# EAGLE design v1 (EAGLE 8.5.1)

## Sheet 1 of 4: power
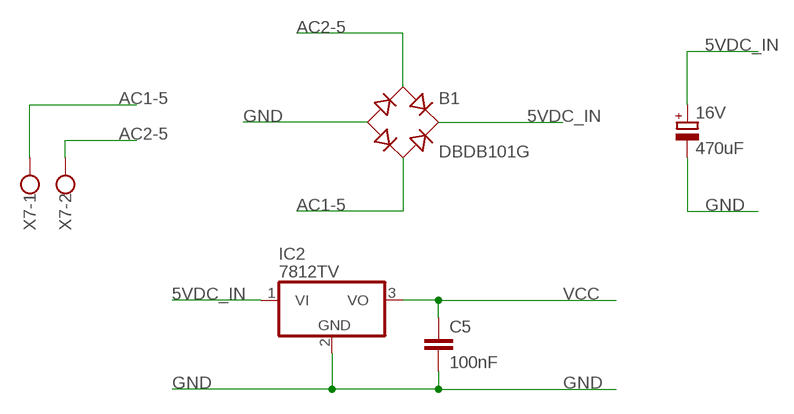
[diagram p0: schematic, sheet 1]

### Parts
16V  470uF  CPOL-EUE3.5-8  [E3,5-8]
B1  DBDB101G  [DB]
C5  100nF  C-EU050-025X075  [C050-025X075]
IC2  7812TV  [TO220V]
X7  W237-102  [W237-102]

### Nets
5VDC_IN: 16V.+ B1.+ IC2.1(VI) ; also sheet 4
AC1-5: B1.AC2 X7.1
AC2-5: B1.AC1 X7.2
GND: 16V.- B1.- C5.2 IC2.2(GND) ; also sheet 2,3,4
VCC: C5.1 IC2.3(VO) ; also sheet 2,3

## Sheet 2 of 4
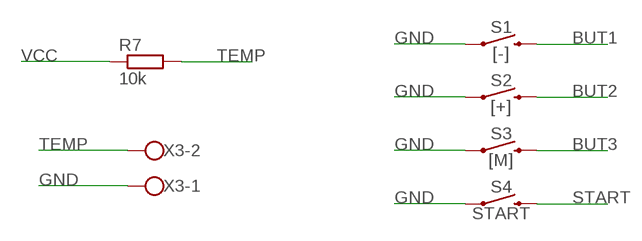
[diagram p1: schematic, sheet 2]

### Parts
R7  10k  R-EU_0207/10  [0207/10]
S1  [-]  MOMENTARY-SWITCH-SPST-PTH-6.0MM  [TACTILE_SWITCH_PTH_6.0MM]
S2  [+]  MOMENTARY-SWITCH-SPST-PTH-6.0MM  [TACTILE_SWITCH_PTH_6.0MM]
S3  [M]  MOMENTARY-SWITCH-SPST-PTH-6.0MM  [TACTILE_SWITCH_PTH_6.0MM]
S4  START  MOMENTARY-SWITCH-SPST-PTH-6.0MM  [TACTILE_SWITCH_PTH_6.0MM]
X3  W237-102  [W237-102]

### Nets
BUT1: S1.3 ; also sheet 3
BUT2: S2.3 ; also sheet 3
BUT3: S3.3 ; also sheet 3
GND: S1.1 S2.1 S3.1 S4.1 X3.1 ; also sheet 1,3,4
START: S4.3 ; also sheet 3
TEMP: R7.2 X3.2 ; also sheet 3
VCC: R7.1 ; also sheet 1,3

## Sheet 3 of 4: process
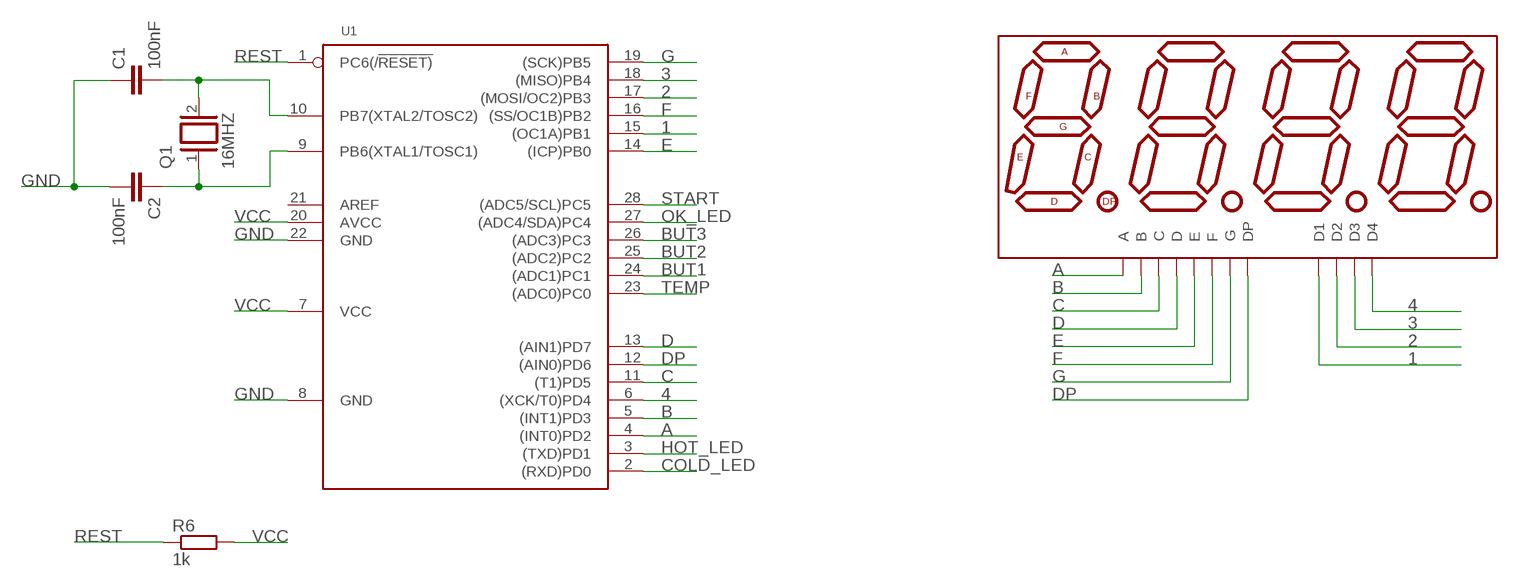
[diagram p2: schematic, sheet 3]

### Parts
C1  100nF  C-EU050-025X075  [C050-025X075]
C2  100nF  C-EU050-025X075  [C050-025X075]
DISP2  ATA8041AB  7-SEGMENT-4DIGIT-20MM-BLUE  [7-SEGMENT-4DIGIT-20MM]
Q1  16MHZ  XTAL/S  [QS]
R6  1k  R-EU_0207/10  [0207/10]
U1  MCU-ATMEGA328P-PU(DIP28)  [DIP28-2.54-34.7X7.62MM]

### Nets
1: DISP2.12(D1) U1.15((OC1A)PB1)
2: DISP2.9(D2) U1.17((MOSI/OC2)PB3)
3: DISP2.8(D3) U1.18((MISO)PB4)
4: DISP2.6(D4) U1.6((XCK/T0)PD4)
A: DISP2.11(A) U1.4((INT0)PD2)
B: DISP2.7(B) U1.5((INT1)PD3)
BUT1: U1.24((ADC1)PC1) ; also sheet 2
BUT2: U1.25((ADC2)PC2) ; also sheet 2
BUT3: U1.26((ADC3)PC3) ; also sheet 2
C: DISP2.4(C) U1.11((T1)PD5)
COLD_LED: U1.2((RXD)PD0) ; also sheet 4
D: DISP2.2(D) U1.13((AIN1)PD7)
DP: DISP2.3(DP) U1.12((AIN0)PD6)
E: DISP2.1(E) U1.14((ICP)PB0)
F: DISP2.10(F) U1.16((SS/OC1B)PB2)
G: DISP2.5(G) U1.19((SCK)PB5)
GND: C1.1 C2.2 U1.8(GND) U1.22(GND) ; also sheet 1,2,4
HOT_LED: U1.3((TXD)PD1) ; also sheet 4
N$1: C1.2 Q1.2 U1.10(PB7(XTAL2/TOSC2))
N$2: C2.1 Q1.1 U1.9(PB6(XTAL1/TOSC1))
OK_LED: U1.27((ADC4/SDA)PC4) ; also sheet 4
REST: R6.1 U1.1(PC6(/!RESET))
START: U1.28((ADC5/SCL)PC5) ; also sheet 2
TEMP: U1.23((ADC0)PC0) ; also sheet 2
VCC: R6.2 U1.7(VCC) U1.20(AVCC) ; also sheet 1,2
Unconnected: U1.21(AREF)

## Sheet 4 of 4: output
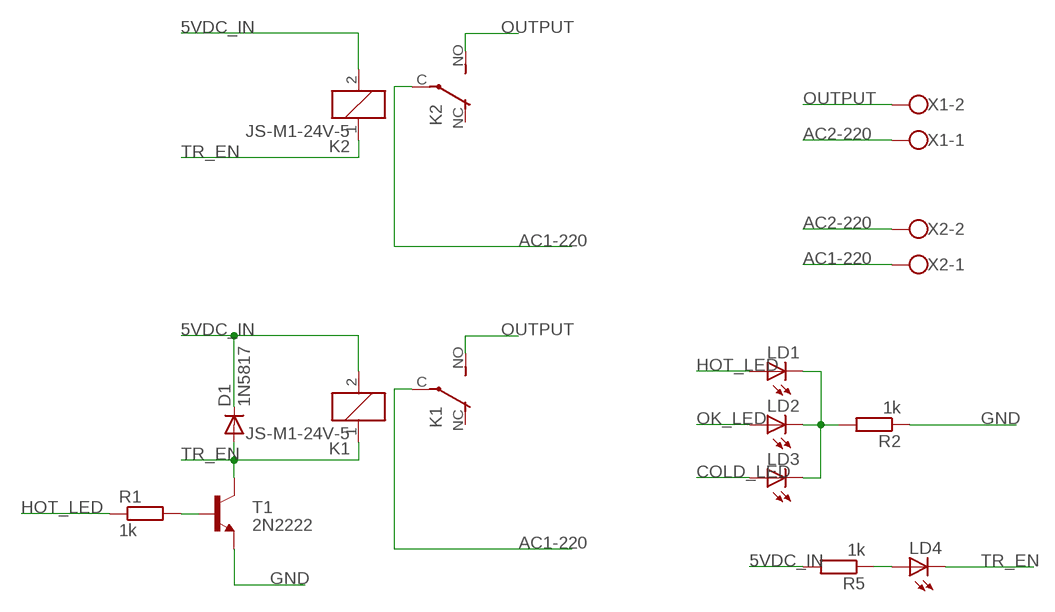
[diagram p3: schematic, sheet 4]

### Parts
D1  1N5817  1N4004  [DO41-10]
K1  JS-M1-24V-5  JS-M1-12V-5  [JS-M]
K2  JS-M1-24V-5  JS-M1-12V-5  [JS-M]
LD1  LED5MM  [LED5MM]
LD2  LED5MM  [LED5MM]
LD3  LED5MM  [LED5MM]
LD4  LED5MM  [LED5MM]
R1  1k  R-EU_0207/10  [0207/10]
R2  1k  R-EU_0207/10  [0207/10]
R5  1k  R-EU_0207/10  [0207/10]
T1  2N2222  [TO92-EBC-OVAL]
X1  W237-102  [W237-102]
X2  W237-102  [W237-102]

### Nets
5VDC_IN: D1.C K1.2 K2.2 R5.2 ; also sheet 1
AC1-220: K1.C(2:P) K2.C(2:P) X2.1
AC2-220: X1.1 X2.2
COLD_LED: LD3.A ; also sheet 3
GND: R2.1 T1.E ; also sheet 1,2,3
HOT_LED: LD1.A R1.1 ; also sheet 3
N$3: LD4.A R5.1
N$4: LD1.K(C) LD2.K(C) LD3.K(C) R2.2
N$7: R1.2 T1.B
OK_LED: LD2.A ; also sheet 3
OUTPUT: K1.NO(2:S) K2.NO(2:S) X1.2
TR_EN: D1.A K1.1 K2.1 LD4.K(C) T1.C
Unconnected: K1.NC(2:O) K2.NC(2:O)

## Library data of the parts
16V = rcl:CPOL-EU: POLARIZED CAPACITOR, European symbol; SPICEPREFIX: C
B1 = rectifier:DB?*G: Single Phase 1.0 AMP Glass Passivated Bridge Rectifier Taiwan Semiconductor Co.,Ltd. - TSC Source: http://www.taiwansemi.com/TSCbig5/ezcatfiles/cust/img/img/db101g.pdf http://www.ts.com.tw/db/pictures/modules/PDT/PDT060207001/DBLS201G.pdf
C1 C2 C5 = rcl:C-EU: CAPACITOR, European symbol; SPICEPREFIX: C
D1 = adafruit:1N4004: DIODE General purpose 1N400x type rectifier (With bigger pads) http://www.ladyada.net/library/pcb/eaglelibrary.html
DISP2 = SparkFun-LED:7-SEGMENT-4DIGIT-20MM: 4 Digit 7 Segment Display This is a part for the 4-Digit 7-segment LEDs from Young Sun. Different from the Digikey LEDs, all 16 pins are used. The LONGPADS Variant is used for a test jig, but you may like it because there is more pad to solder to. If you are concerned about routing space, the standard works just fine though. Datasheets: Red <http://cdn.sparkfun.com/datasheets/Components/LED/1LEDREDCC.pdf> Yellow <http://cdn.sparkfun.com/datasheets/Components/LED/1LEDYELCC.pdf> Green <http://cdn.sparkfun.com/datasheets/Components/LED/1LEDGRNCC.pdf> Blue <http://cdn.sparkfun.com/datasheets/Components/LED/1LEDBLUCC.pdf> White <http://cdn.sparkfun.com/datasheets/Components/LED/1LEDWHTCC.pdf> SparkFun Products Raw Components 7-Segment Display - 20mm (Red) <https://www.sparkfun.com/products/11405> (COM-11405) 7-Segment Display - 20mm (Yellow) <https://www.sparkfun.com/products/11406> (COM-11406) 7-Segment Display - 20mm (Green) <https://www.sparkfun.com/products/11407> (COM-11407) 7-Segment Display - 20mm (Blue) <https://www.sparkfun.com/products/11408> (COM-11408) 7-Segment Display - 20mm (White) <https://www.sparkfun.com/products/11409> (COM-11409) Serial Controlled SparkFun OpenSegment Serial Display - 20mm (Red) <https://www.sparkfun.com/products/11644> (COM-11644) SparkFun OpenSegment Serial Display - 20mm (Yellow) <https://www.sparkfun.com/products/11645> (COM-11645) SparkFun OpenSegment Serial Display - 20mm (Green) <https://www.sparkfun.com/products/11646> (COM-11646) SparkFun OpenSegment Serial Display - 20mm (Blue) <https://www.sparkfun.com/products/11647> (COM-11647) SparkFun OpenSegment Serial Display - 20mm (White) <https://www.sparkfun.com/products/11648> (COM-11648) Other SparkFun OpenSegment Shield <https://www.sparkfun.com/products/13190> (DEV-13190); PROD_ID: COMP-11446
IC2 = linear:78*: Positive VOLTAGE REGULATOR Source: http://cache.national.com/ds/LM/LM78L05.pdf http://www.fairchildsemi.com/ds/LM/LM7805.pdf
K1 K2 = relay:JS-M1*: Automotive Ultra-Miniature Power Relay NAiS Source: http://www.mew-europe.com/.. en_ds_61211_0000.pdf; MF: FARNELL; MPN: JSM1-12V-5; OC_FARNELL: 910351; OC_NEWARK: 14J1764
LD1-LD4 = led:LED: LED OSRAM: - CHIPLED LG R971, LG N971, LY N971, LG Q971, LY Q971, LO R971, LY R971 LH N974, LH R974 LS Q976, LO Q976, LY Q976 LO Q996 - Hyper CHIPLED LW Q18S LB Q993, LB Q99A, LB R99A - SideLED LS A670, LO A670, LY A670, LG A670, LP A670 LB A673, LV A673, LT A673, LW A673 LH A674 LY A675 LS A676, LA A676, LO A676, LY A676, LW A676 LS A679, LY A679, LG A679 - Hyper Micro SIDELED® LS Y876, LA Y876, LO Y876, LY Y876 LT Y87S - SmartLED LW L88C, LW L88S LB L89C, LB L89S, LG L890 LS L89K, LO L89K, LY L89K LS L896, LA L896, LO L896, LY L896 - TOPLED LS T670, LO T670, LY T670, LG T670, LP T670 LSG T670, LSP T670, LSY T670, LOP T670, LYG T670 LG T671, LOG T671, LSG T671 LB T673, LV T673, LT T673, LW T673 LH T674 LS T676, LA T676, LO T676, LY T676, LB T676, LH T676, LSB T676, LW T676 LB T67C, LV T67C, LT T67C, LS T67K, LO T67K, LY T67K, LW E67C LS E67B, LA E67B, LO E67B, LY E67B, LB E67C, LV E67C, LT E67C LW T67C LS T679, LY T679, LG T679 LS T770, LO T770, LY T770, LG T770, LP T770 LB T773, LV T773, LT T773, LW T773 LH T774 LS E675, LA E675, LY E675, LS T675 LS T776, LA T776, LO T776, LY T776, LB T776 LHGB T686 LT T68C, LB T68C - Hyper Mini TOPLED® LB M676 - Mini TOPLED Santana® LG M470 LS M47K, LO M47K, LY M47K Source: http://www.osram.convergy.de/
Q1 = special:XTAL/S: CRYSTAL
R1 R2 R5-R7 = rcl-2:R-EU_: RESISTOR, European symbol
S1-S4 = SparkFun-Switches:MOMENTARY-SWITCH-SPST: Momentary Switch (Pushbutton) - SPST Normally-open (NO) SPST momentary switches (buttons, pushbuttons). Variants PTH-12MM - 12mm square, through-hole Momentary Pushbutton Switch - 12mm Square <https://www.sparkfun.com/products/9190> (COM-09190) PTH-6.0MM, PTH-6.0MM-KIT - 6.0mm square, through-hole Mini Pushbutton Switch <https://www.sparkfun.com/products/97> (COM-00097) KIT package intended for soldering kit's - only one side of pads' copper is exposed. PTH-RIGHT-ANGLE-KIT - Right-angle, through-hole Right Angle Tactile Button <https://www.sparkfun.com/products/10791> - Used on SparkFun BigTime Watch Kit <https://www.sparkfun.com/products/11734> SMD-12MM - 12mm square, surface-mount Tactile Button - SMD (12mm) <https://www.sparkfun.com/products/12993> (COM-12993) Used on SparkFun PicoBoard <https://www.sparkfun.com/products/11888> SMD-4.5MM - 4.5mm Square Trackball Switch Used on SparkFun Blackberry Trackballer Breakout <https://www.sparkfun.com/products/13169> SMD-4.6MMX2.8MM - 4.60mm x 2.80mm, surface mount Used on SparkFun SAMD21 Mini Breakout <https://www.sparkfun.com/products/13664> SMD-5.2MM, SMD-5.2-REDUNDANT - 5.2mm square, surface-mount Mini Pushbutton Switch - SMD <https://www.sparkfun.com/products/8720> (COM-08720) Used on Arduino Pro Mini <https://www.sparkfun.com/products/11114> REDUNDANT package connects both switch circuits together SMD-6.0X3.5MM - 6.0 x 3.5mm, surface mount Momentary Reset Switch SMD <https://www.sparkfun.com/products/8229> (COM-08229) SMD-6.2MM-TALL - 6.2mm square, surface mount Tactile Button - SMD (6mm) <https://www.sparkfun.com/products/12992> Used on SparkFun Digital Sandbox <https://www.sparkfun.com/products/12651> SMD-RIGHT-ANGLE - Right-angle, surface mount Used on SparkFun Block for Intel® Edison - Arduino <https://www.sparkfun.com/products/13036>; PROD_ID: SWCH-08441; SF_SKU: COM-00097
T1 = adafruit:2N2222: NPN TRANSISTOR Big oval pads
U1 = Seeed-IC:MCU-ATMEGA328P-PU(DIP28): 310010051; MPN: ATMEGA328P-PU
X1-X3 X7 = con-wago-500:W237-102: WAGO SCREW CLAMP

## Board
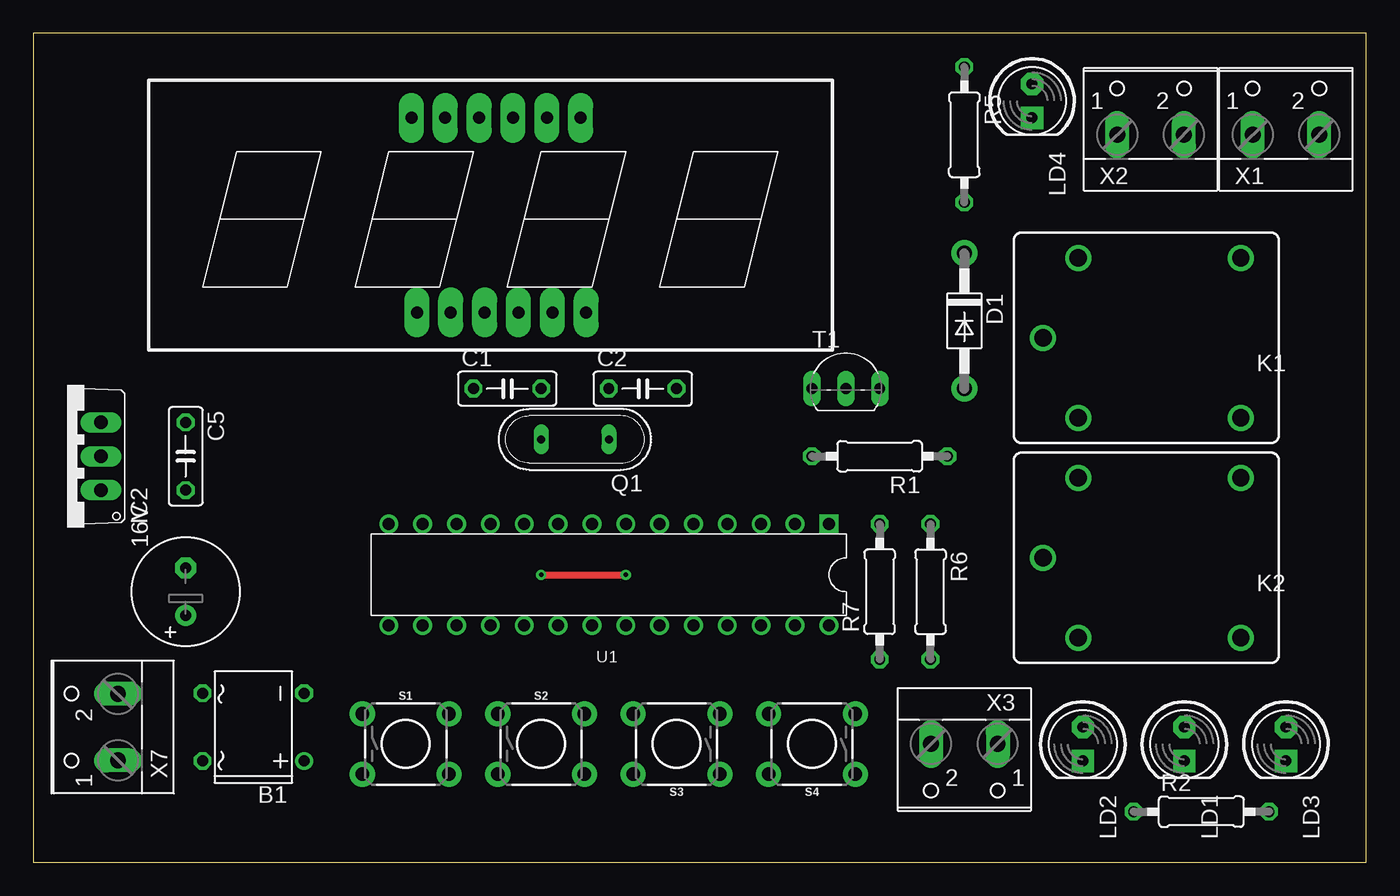
[diagram p4: board, top side]
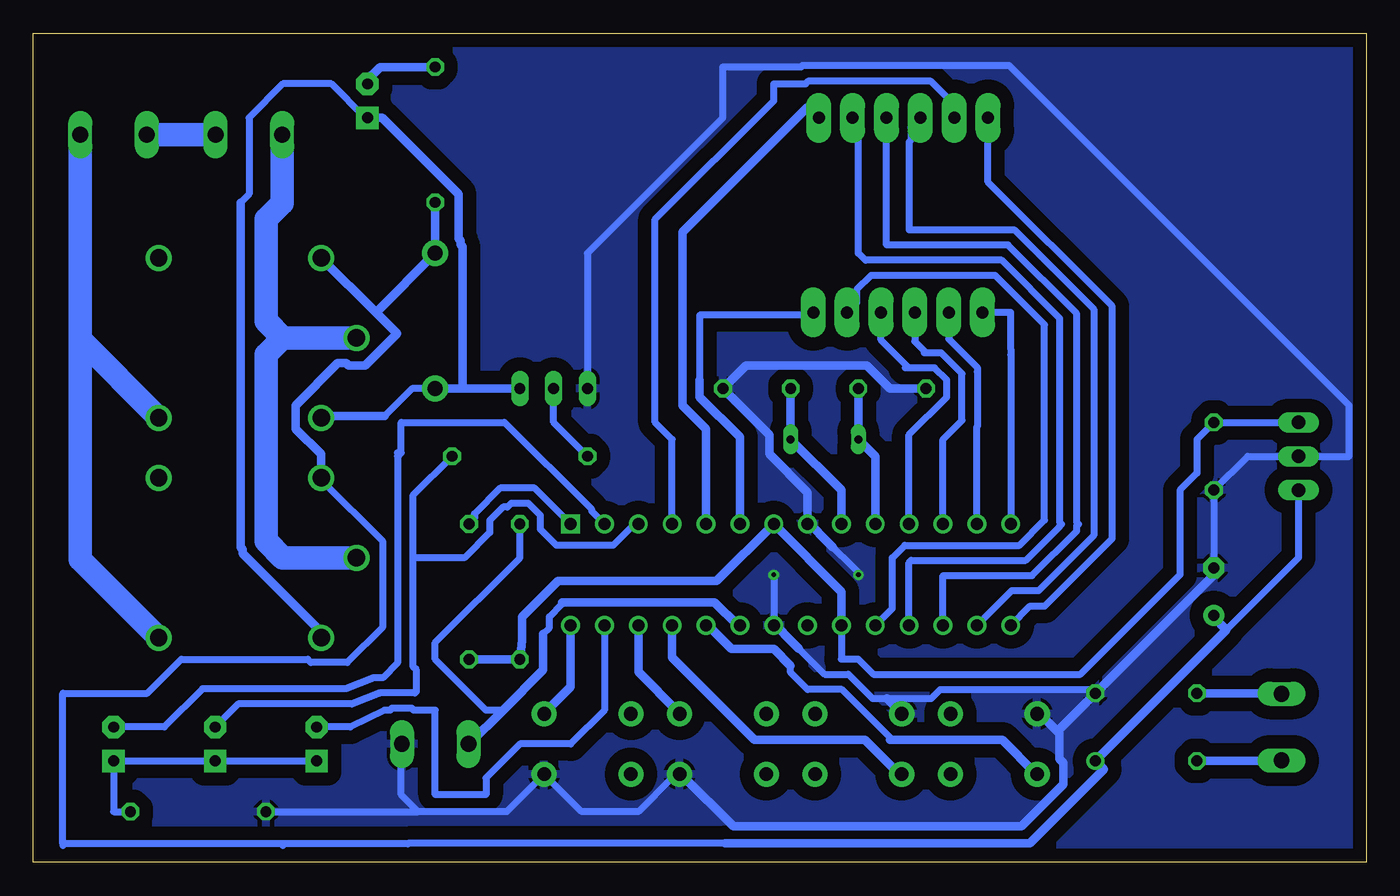
[diagram p5: board, bottom side, seen from below]

Size 100 x 62.22 mm. Coordinates in mm from the lower left corner, seen from the top.
Outline: 0,0 100,0 100,62.22 0,62.22 0,0
Copper layers (1*16): Top 0.035mm / dielectric 1.5mm / Bottom 0.035mm
Design rules "default *": minimum track width 25mil, minimum drill 0.35mm, track to track 40mil, track to pad 40mil, pad to pad 6mil, via to via 6mil, smd to smd 6mil, copper to edge 40mil, drill to drill 6mil, minimum pad ring 10mil, minimum via ring 8mil, stop-mask expansion 4mil, vias tented up to drill 0mil, thermal gap 10mil

### Footprints (pad centres in the part's own frame; a part is rotated, then mirrored left to right if it is on the bottom)
E3,5-8 = drill 0.813 pad 1.6: + -1.778,0 | drill 0.813 pad 1.6 octagon: - 1.778,0
DB = drill 0.813: + -2.54,-3.81 | drill 0.813 octagon: - 2.54,-3.81; AC1 2.54,3.81; AC2 -2.54,3.81
C050-025X075 = drill 0.813 octagon: 1 -2.54,0; 2 2.54,0
DO41-10 = drill 1.118 pad 1.93: A 5.08,0; C -5.08,0
7-SEGMENT-4DIGIT-20MM = drill 0.9 pad 1.88 long: 1 -5.512,-6.985; 2 -2.972,-6.985; 3 -0.432,-6.985; 4 2.108,-6.985; 5 4.648,-6.985; 6 7.188,-6.985; 7 6.782,7.62; 8 4.242,7.62; 9 1.702,7.62; 10 -0.838,7.62; 11 -3.378,7.62; 12 -5.918,7.62
TO220V = drill 1.016 long: 1 -2.54,-2.54; 2 0,-2.54; 3 2.54,-2.54
JS-M = drill 1.3: 1 6.7,6; 2 6.7,-6; C 9.335,0; NC -5.5,-6; NO -5.5,6
LED5MM = drill 0.813 pad 1.676 octagon: A -1.27,0 | drill 0.813 pad 1.676 square: K 1.27,0
QS = drill 0.61 long: 1 -2.54,0; 2 2.54,0
0207/10 = drill 0.813 octagon: 1 -5.08,0; 2 5.08,0
TACTILE_SWITCH_PTH_6.0MM = drill 1.016 pad 1.88: 1 -3.251,2.261; 2 3.251,2.261; 3 -3.251,-2.261; 4 3.251,-2.261
TO92-EBC-OVAL = drill 0.813 long: B 0,-1.27; C 2.54,-1.27; E -2.54,-1.27
DIP28-2.54-34.7X7.62MM = drill 0.9 pad 1.4 square: 1 -16.51,-3.81 | drill 0.9 pad 1.4: 2 -13.97,-3.81; 3 -11.43,-3.81; 4 -8.89,-3.81; 5 -6.35,-3.81; 6 -3.81,-3.81; 7 -1.27,-3.81; 8 1.27,-3.81; 9 3.81,-3.81; 10 6.35,-3.81; 11 8.89,-3.81; 12 11.43,-3.81; 13 13.97,-3.81; 14 16.51,-3.81; 15 16.51,3.81; 16 13.97,3.81; 17 11.43,3.81; 18 8.89,3.81; 19 6.35,3.81; 20 3.81,3.81; 21 1.27,3.81; 22 -1.27,3.81; 23 -3.81,3.81; 24 -6.35,3.81; 25 -8.89,3.81; 26 -11.43,3.81; 27 -13.97,3.81; 28 -16.51,3.81
W237-102 = drill 1.194 long: 1 -2.5,-1.27; 2 2.5,-1.27

### Placement (x,y rotation side)
16V  11.43,20.32 90 top
B1  16.51,10.16 90 top
C1  35.56,35.56 0 top
C2  45.72,35.56 0 top
C5  11.43,30.48 270 top
D1  69.85,40.64 270 top
DISP2  34.29,48.26 0 top
IC2  2.54,30.48 90 top
K1  85.09,39.37 180 top
K2  85.09,22.86 180 top
LD1  86.36,8.89 270 top
LD2  78.74,8.89 270 top
LD3  93.98,8.89 270 top
LD4  74.93,57.15 270 top
Q1  40.64,31.75 180 top
R1  63.5,30.48 180 top
R2  87.63,3.81 0 top
R5  69.85,54.61 270 top
R6  67.31,20.32 270 top
R7  63.5,20.32 90 top
S1  27.94,8.89 0 top
S2  38.1,8.89 0 top
S3  48.26,8.89 180 top
S4  58.42,8.89 180 top
T1  60.96,36.83 0 top
U1  43.18,21.59 180 top
X1  93.98,55.88 0 top
X2  83.82,55.88 0 top
X3  69.85,7.62 180 top
X7  5.08,10.16 90 top

### Tracks (layer width: path | path; a pad name or v marks a point on that pad's centre or on a via)
1
  Bottom 0.508: U1.15 25.21,19.23 24.12,19.23 19.05,24.3 19.05,41.74 28.37,51.06 DISP2.12
2
  Bottom 0.508: U1.17 31.75,21.52 25.06,21.52 21.72,24.87 21.72,25.27 21.59,25.4 21.72,25.53 21.72,41.17 26.88,46.33 35.99,46.33 DISP2.9
3
  Bottom 0.508: U1.18 34.29,22.51 34.14,22.66 25.54,22.66 22.99,25.21 22.99,25.27 22.86,25.4 22.99,25.53 22.99,40.83 27.35,45.19 37.57,45.19 38.1,45.72 38.1,55.88 DISP2.8
4
  Bottom 0.508: 50.01,35.56 50.01,41.07 41.68,41.07 DISP2.6
  Bottom 0.635: U1.6 46.99,31.91 50.01,34.92 50.01,35.56 50.01,36.2
5VDC_IN
  Bottom 0.508: IC2.1 5.08,22.86 10.48,17.46 | 48.1,1.43 71.89,1.43 71.92,1.4 81.15,1.4 | 81.15,1.4 81.28,1.27 | 81.15,1.4 97.79,1.4 | 97.79,1.4 97.79,1.27 | 97.79,1.4 97.79,12.7 91.44,12.7 88.9,15.24 79.41,15.24 79.16,15 76.44,15 73.81,17.63 73.81,24.13 78.39,28.71 K2.2
  Bottom 0.635: R5.2 D1.C 74.3,41.27 | K1.2 74.3,41.27 | 74.3,41.27 72.71,39.69 75.09,37.31 76.36,37.31 76.52,37.47 77.15,37.47 80.33,34.29 80.33,32.54 78.42,30.64 78.42,28.89 K2.2 | 16V.+ 11.43,18.41 10.48,17.46 B1.+ 19.68,6.99 25.24,1.43 48.1,1.43
A
  Bottom 0.508: U1.4 52.07,31.75 53.34,33.02 53.34,48.26 44.45,57.15 44.45,58.42 42.06,58.42 41.83,58.65 32.69,58.65 30.91,56.87 DISP2.11
AC1-5
  Bottom 0.635: B1.AC2 6.35,7.62 X7.1
AC1-220
  Bottom 1.778: 81.28,39.37 82.55,40.64 82.55,48.26 81.32,49.49 X2.1 | 81.28,39.37 K1.C | 81.28,39.37 82.55,38.1 82.55,24.13 81.28,22.86 K2.C
AC2-5
  Bottom 0.635: B1.AC1 6.35,12.7 X7.2
AC2-220
  Bottom 1.778: X1.1 X2.2
B
  Bottom 0.635: U1.5 49.53,32.54 51.28,34.29 51.28,47.31 41.91,56.67 DISP2.7
BUT1
  Bottom 0.508: 35.56,9.21 39.33,12.98 41.91,12.98 43.18,14.25 43.18,14.76
  Bottom 0.635: U1.24 49.37,17.78 47.62,16.03 44.45,16.03 43.18,14.76 | 35.72,9.21 35.56,9.21 27.3,9.21 24.77,6.67 S1.3
BUT2
  Bottom 0.635: U1.25 52.07,15.4 45.88,9.21 37.62,9.21 34.92,6.51 S2.3
BUT3
  Bottom 0.635: U1.26 54.61,14.29 51.59,11.27 S3.3
C
  Bottom 0.508: U1.11 34.29,32.1 31.47,34.92 31.47,36.2 32.38,37.11 34.29,37.11 | 34.29,37.11 34.57,37.11 | 34.29,37.11 36.4,39.22 DISP2.4
COLD_LED
  Bottom 0.508: LD3.A 90.17,10.16 87.3,13.03 76.56,13.03 74.47,13.86 73.77,13.86 72.67,14.96 72.67,30.48 | U1.2 58.1,26.35 58.1,26.47 64.64,33.02 72.39,33.02 72.39,30.76 72.67,30.48 | 72.67,30.76 72.67,30.48
D
  Bottom 0.508: U1.13 29.21,32.67 29.18,32.7 29.18,36.83 29.18,37.15 31.32,39.28 DISP2.2 31.32,40.64 31.75,40.64
DP
  Bottom 0.508: U1.12 31.75,31.75 30.33,33.17 30.33,36.67 31.91,38.25 33.02,38.25 | 33.17,38.25 33.02,38.25 | DISP2.3 33.86,39.09 33.02,38.25
E
  Bottom 0.508: U1.14 26.67,38.1 26.67,38.53 26.67,41.27 DISP2.1
F
  Bottom 0.508: DISP2.10 34.16,55.17 34.16,54.18 34.29,54.06 34.29,47.47 26.4,47.47 20.45,41.52 20.45,24.52 24.59,20.38 26.61,20.38 U1.16
G
  Bottom 0.508: U1.19 35.56,19.05 35.56,22.86 34.61,23.81 26.01,23.81 24.13,25.69 24.13,40.35 27.82,44.04 37.16,44.04 38.23,42.97 38.23,41.99 DISP2.5
GND  (via drill 0.35)
  Top 0.508: v38.1,21.59 v44.45,21.59
  Bottom 0.508: 19.05,13.97 20.04,12.98 31.95,12.98 32.62,12.3 35.96,12.3 37.04,12.3 38.86,14.12 40.63,14.12 43.1,16.59 | T1.E 58.42,45.72 48.26,55.88 48.26,59.69 42.4,59.69 42.3,59.79 26.77,59.79 1.27,34.29 1.27,30.48 IC2.2 8.89,30.48 C5.2 11.43,21.59 | S3.1 51.79,6.35 52.07,6.35 54.61,3.81 58.85,3.81 S4.1 64.49,3.81 71.12,3.81 | 71.12,3.81 72.39,5.08 72.39,8.85 X3.1 | R2.1 71.12,3.81 | 40.56,24.21 38.1,21.75 v38.1,21.59 | v44.45,21.59 U1.22
  Bottom 0.635: U1.22 44.29,17.78 43.1,16.59 42.55,16.03 | 35.96,12.3 34.92,11.27 S2.1 34.61,11.27 | 23.18,9.84 B1.- 19.05,13.97 11.43,21.59 11.27,21.75 11.43,21.91 16V.- 11.43,22.23 | 23.18,9.84 24.61,11.27 S1.1 24.92,11.11 | C1.1 35.72,35.56 37.47,37.31 46.51,37.31 C2.2 44.77,32.07 44.77,30.64 41.91,27.78 U1.8 41.75,25.24 41.59,25.24 40.56,24.21 40.01,23.65 | 23.18,9.84 23.02,9.68 23.02,7.78 22.7,7.46 22.7,5.87 25.88,2.7 47.47,2.7 51.28,6.51 S3.1
  pour Bottom: 0,62.23 100.33,62.23 100.33,0 0,0
HOT_LED
  Bottom 0.508: U1.3 54.9,25.4 56.49,23.81 60.76,23.81 61.95,25 61.95,26.04 62.86,26.95 64.14,26.95 64.42,26.67 64.77,26.67 65.76,25.68 65.76,24.76 67.66,22.86 71.53,22.86 | 71.53,22.86 71.53,27.53 R1.1 | 71.53,22.86 71.53,14.72 71.25,14.44 71.25,12.82 71.36,12.71 73.99,12.71 76.09,11.89 84.63,11.89 LD1.A
N$1
  Bottom 0.635: C1.2 Q1.2 36.83,30.48 U1.10
N$2
  Bottom 0.635: C2.1 Q1.1 39.37,27.94 U1.9
N$3
  Bottom 0.635: R5.1 73.98,59.69 75.09,58.58 LD4.A
N$4
  Bottom 0.508: LD2.K LD1.K LD3.K 93.98,3.81 R2.2
N$7
  Bottom 0.508: R1.2 60.96,33.02 T1.B
OK_LED
  Bottom 0.508: U1.27 57.15,11.43 59.69,8.89 63.5,8.89 66.04,6.35 66.04,5.08 69.85,5.08 69.85,11.43 71.47,11.43 71.61,11.57 73.09,11.57 73.23,11.43 73.66,11.43 76.2,10.16 LD2.A
OUTPUT
  Bottom 1.778: X1.2 96.48,39.26 | 96.48,39.26 K1.NO | K2.NO 96.48,22.75 96.48,39.26
REST
  Bottom 0.508: R6.1 66.9,25.81 66.9,26.15 64.96,28.09 62.38,28.09 U1.1
START
  Bottom 0.635: U1.28 59.69,13.18 61.59,11.27 S4.3
TEMP
  Bottom 0.508: 61.75,17.14 61.28,17.62 61.28,18.44 60.33,19.4 60.33,19.53 | 64.77,11.43 66.04,11.43 69.85,15.24 69.85,16.51 63.5,22.86 R7.2
  Bottom 0.635: U1.23 47.15,17.78 48.9,19.53 60.33,19.53 | 61.75,17.14 61.75,14.45 64.77,11.43 67.31,8.89 X3.2
TR_EN
  Bottom 0.508: LD4.K 75.09,55.88 77.63,58.42 81.28,58.42 83.82,55.88 83.82,50.16 84.45,49.53 | D1.A 71.6,35.56 73.66,33.5
  Bottom 0.635: 67.79,35.56 D1.A 70.01,35.56 | 67.79,35.56 T1.C | LD4.K 73.82,55.88 68.1,50.16 68.1,46.83 67.94,46.67 67.94,46.35 67.79,46.2 67.79,35.56 | 84.45,49.53 84.45,23.65 84.3,23.5 84.3,23.18 78.42,17.3 78.42,16.99 K2.1 | 73.66,33.5 78.26,33.5 K1.1
VCC
  Bottom 0.508: IC2.3 C5.1 12.7,31.75 12.7,29.21 13.97,27.94 13.97,21.59 21.44,14.12 36.98,14.12 38.12,15.27 39.37,15.27 U1.20
  Bottom 0.635: R6.2 R7.1 63.34,16.67 63.34,18.41 60.64,21.11 48.74,21.11 U1.7 39.37,20.32 U1.20 | 11.59,32.86 C5.1